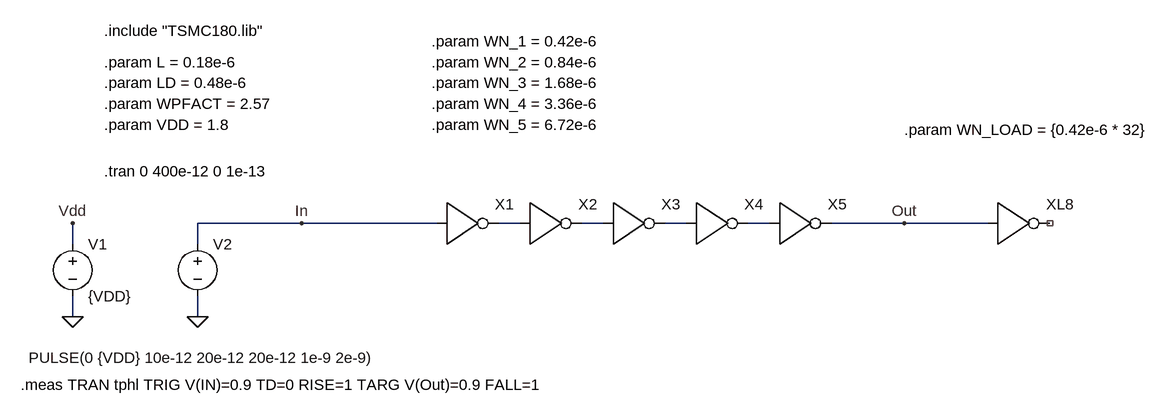
[diagram p0: schematic inverter_chain_5.asc]
inverter_chain_5.asc, the LTspice schematic file:
Version 4
SHEET 1 2756 1748
WIRE 992 208 832 208
WIRE 1200 208 992 208
WIRE 1328 208 1296 208
WIRE 1456 208 1424 208
WIRE 1584 208 1552 208
WIRE 1712 208 1680 208
WIRE 1920 208 1808 208
WIRE 2048 208 1920 208
WIRE 640 240 640 208
WIRE 832 240 832 208
WIRE 640 352 640 320
WIRE 832 352 832 320
FLAG 992 208 In
FLAG 640 352 0
FLAG 640 208 Vdd
FLAG 832 352 0
FLAG 1920 208 Out
SYMBOL voltage 640 224 R0
WINDOW 123 0 0 Left 0
WINDOW 39 0 0 Left 0
SYMATTR InstName V1
SYMATTR Value {VDD}
SYMBOL voltage 832 224 R0
WINDOW 123 0 0 Left 0
WINDOW 39 0 0 Left 0
WINDOW 3 -260 191 Left 2
SYMATTR Value PULSE(0 {VDD} 10e-12 20e-12 20e-12 1e-9 2e-9)
SYMATTR InstName V2
SYMBOL inversor 1216 208 R0
SYMATTR InstName X1
SYMATTR SpiceLine VDD={VDD} L={L} LD={LD} WN={WN_1} WPFACT={WPFACT}
SYMBOL inversor 1344 208 R0
SYMATTR InstName X2
SYMATTR SpiceLine VDD={VDD} L={L} LD={LD} WN={WN_2} WPFACT={WPFACT}
SYMBOL inversor 1472 208 R0
SYMATTR InstName X3
SYMATTR SpiceLine VDD={VDD} L={L} LD={LD} WN={WN_3} WPFACT={WPFACT}
SYMBOL inversor 1600 208 R0
SYMATTR InstName X4
SYMATTR SpiceLine VDD={VDD} L={L} LD={LD} WN={WN_4} WPFACT={WPFACT}
SYMBOL inversor 1728 208 R0
SYMATTR InstName X5
SYMATTR SpiceLine VDD={VDD} L={L} LD={LD} WN={WN_5} WPFACT={WPFACT}
SYMBOL inversor 2064 208 R0
SYMATTR InstName XL8
SYMATTR SpiceLine VDD={VDD} L={L} LD={LD} WN={WN_LOAD} WPFACT={WPFACT}
TEXT 688 -88 Left 2 !.include "TSMC180.lib"
TEXT 688 -40 Left 2 !.param L = 0.18e-6
TEXT 688 -8 Left 2 !.param LD = 0.48e-6
TEXT 688 56 Left 2 !.param VDD = 1.8
TEXT 688 128 Left 2 !.tran 0 400e-12 0 1e-13
TEXT 688 24 Left 2 !.param WPFACT = 2.57
TEXT 1192 -72 Left 2 !.param WN_1 = 0.42e-6
TEXT 1192 -40 Left 2 !.param WN_2 = 0.84e-6
TEXT 560 456 Left 2 !.meas TRAN tphl TRIG V(IN)=0.9 TD=0 RISE=1 TARG V(Out)=0.9 FALL=1
TEXT 1920 64 Left 2 !.param WN_LOAD = {0.42e-6 * 32}
TEXT 1192 -8 Left 2 !.param WN_3 = 1.68e-6
TEXT 1192 24 Left 2 !.param WN_4 = 3.36e-6
TEXT 1192 56 Left 2 !.param WN_5 = 6.72e-6

The netlist it stands for:
* inverter_chain_5.asc
V1 Vdd 0 {VDD}
V2 In 0 PULSE(0 {VDD} 10e-12 20e-12 20e-12 1e-9 2e-9)
XX1 In N001 inversor VDD={VDD} L={L} LD={LD} WN={WN_1} WPFACT={WPFACT}  ; pins In Out
XX2 N001 N002 inversor VDD={VDD} L={L} LD={LD} WN={WN_2} WPFACT={WPFACT}  ; pins In Out
XX3 N002 N003 inversor VDD={VDD} L={L} LD={LD} WN={WN_3} WPFACT={WPFACT}  ; pins In Out
XX4 N003 N004 inversor VDD={VDD} L={L} LD={LD} WN={WN_4} WPFACT={WPFACT}  ; pins In Out
XX5 N004 Out inversor VDD={VDD} L={L} LD={LD} WN={WN_5} WPFACT={WPFACT}  ; pins In Out
XXL8 Out NC_01 inversor VDD={VDD} L={L} LD={LD} WN={WN_LOAD} WPFACT={WPFACT}  ; pins In Out
.include "TSMC180.lib"
.param L = 0.18e-6
.param LD = 0.48e-6
.param VDD = 1.8
.tran 0 400e-12 0 1e-13
.param WPFACT = 2.57
.param WN_1 = 0.42e-6
.param WN_2 = 0.84e-6
.meas TRAN tphl TRIG V(IN)=0.9 TD=0 RISE=1 TARG V(Out)=0.9 FALL=1
.param WN_LOAD = {0.42e-6 * 32}
.param WN_3 = 1.68e-6
.param WN_4 = 3.36e-6
.param WN_5 = 6.72e-6
.backanno
.end